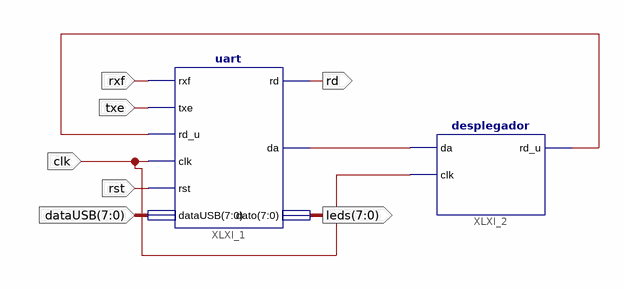
[diagram p0: schematic sheet 1]
// Xilinx ISE schematic top.sch (spartan3e) as structural Verilog: 2 symbols, 7 ports
module top (
  input  rxf,
  input  txe,
  input  clk,
  input  rst,
  input  [7:0] dataUSB,
  output rd,
  output [7:0] leds
);

  wire XLXN_1, XLXN_2;

  uart XLXI_1 (
    .rxf(rxf), .txe(txe), .rd_u(XLXN_2), .clk(clk), .rst(rst), .dataUSB(dataUSB), .rd(rd), .da(XLXN_1),
    .dato(leds));
  desplegador XLXI_2 (.da(XLXN_1), .clk(clk), .rd_u(XLXN_2));
endmodule
